# Altium schematic sheet Radio_XBP9X_DMRS_001.SchDoc
size A
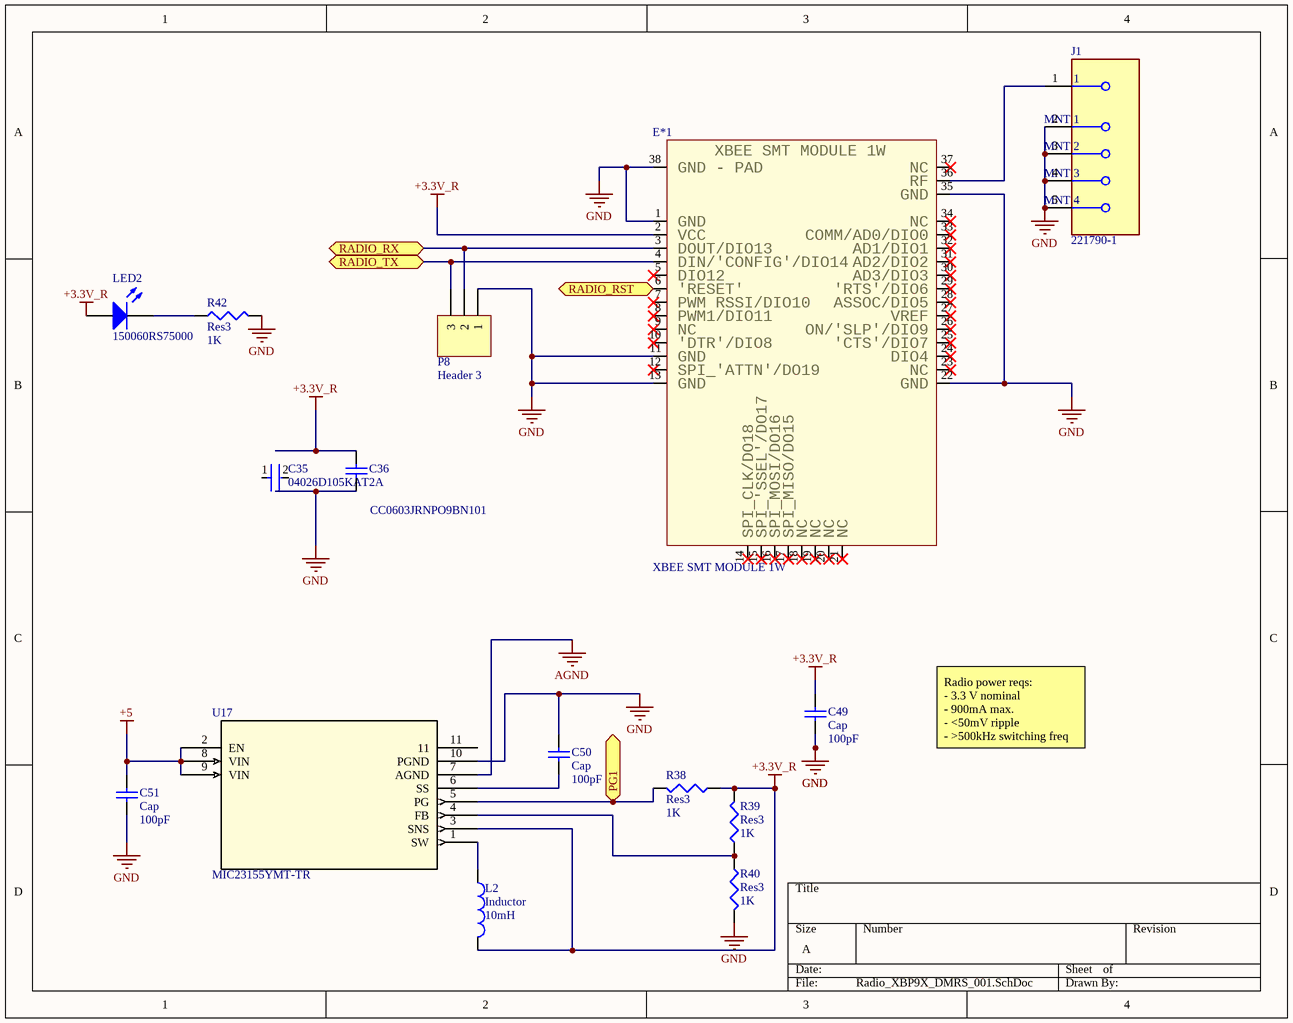
[diagram p0: Radio_XBP9X_DMRS_001.SchDoc]

## Parts
C35  04026D105KAT2A  [FP-0402-L_1_0_1-W_0_5_0_1-MFG]
C36  CC0603JRNPO9BN101  [CAPC1608X90X40ML10T20]
C49  Cap  value 100pF  [RAD-0.3]
C50  Cap  value 100pF  [RAD-0.3]
C51  Cap  value 100pF  [RAD-0.3]
E*1  XBEE SMT MODULE 1W
J1  221790-1  [FP-221790-1-MFG]
L2  Inductor  value 10mH  [0402-A]
LED2  150060RS75000  [0603_A]
P8  Header 3  [HDR1X3]
R38  Res3  value 1K  [J1-0603]
R39  Res3  value 1K  [J1-0603]
R40  Res3  value 1K  [J1-0603]
R42  Res3  value 1K  [J1-0603]
U17  MIC23155YMT-TR  [DFN-10_MCH]

## Ports
PG1 (bidir), RADIO_RST (bidir), RADIO_RX (bidir), RADIO_TX (bidir)

## Nets
+3.3V_R: C36.2 C49.2 E*1.2 L2.2 LED2.2(A) R38.1 R39.2 U17.3(SNS)
+5: C51.2 U17.2(EN) U17.8(VIN) U17.9(VIN)
AGND: U17.7(AGND)
GND: C36.1 C49.1 C50.2 C51.1 E*1.1 E*1.11 E*1.13 E*1.22 E*1.35 E*1.38 J1.2(MNT_1) J1.3(MNT_2) J1.4(MNT_3) J1.5(MNT_4) P8.1 R40.2 R42.2 U17.10(PGND)
PG1: R38.2 U17.5(PG) ; port PG1
RADIO_RST: E*1.6 ; port RADIO_RST
RADIO_RX: E*1.3 P8.2 ; port RADIO_RX
RADIO_TX: E*1.4 P8.3 ; port RADIO_TX
NetC50_1: C50.1 U17.6(SS)
NetE*1_36: E*1.36 J1.1
NetL2_1: L2.1 U17.1(SW)
NetLED2_1: LED2.1(K) R42.1
NetR39_1: R39.1 R40.1 U17.4(FB)

Not connected (* = marked no-connect by the designer): C35 1 2; E*1 5* 7* 8* 9* 10* 12* 14* 15* 16* 17* 18* 19* 20* 21* 23* 24* 25* 26* 27* 28* 29* 30* 31* 32* 33* 34* 37*; U17 11

## Notes on the sheet
- Radio power reqs:
  - 3.3 V nominal
  - 900mA max.
  - <50mV ripple
  - >500kHz switching freq
- (in symbol XBEE SMT MODULE 1W) GND - PAD; NC; RF; GND; VCC; COMM/AD0/DIO0; DOUT/DIO13; AD1/DIO1; DIN/'CONFIG'/DIO14; AD2/DIO2; DIO12; AD3/DIO3; 'RESET'; 'RTS'/DIO6; PWM RSSI/DIO10; ASSOC/DIO5; PWM1/DIO11; VREF; ON/'SLP'/DIO9; 'DTR'/DIO8; 'CTS'/DIO7; DIO4; SPI_'ATTN'/DO19; SPI_CLK/DO18; SPI_'SSEL'/DO17; SPI_MOSI/DO16; SPI_MISO/DO15

## Library data of the parts
C35 = CMP-1034-02113-3: General Purpose Ceramic Capacitor, 0402, 1uF, 10%, X5R, 15%, 6.3V; Tolerance: 10%; Max Operating Temperature: 85°C; Packaging: Tape and Reel; Case Code (Imperial): 0402; Radiation Hardening: No; RoHS Compliant: Yes; Voltage: 6.3V; REACH SVHC: No SVHC; Series: -; Package Quantity: 1; Thickness: 0.022inch; Termination: SMD/SMT; Lead Free: Lead Free; Height: 0.56mm; Mount: Surface Mount; Voltage Rating (DC): 6.3V; Construction: Flat; Min Operating Temperature: -55°C; Capacitance: 1uF; Length: 1mm; Depth: 0.5mm; Voltage Rating: 6.3V; Case Code (Metric): 1005; Contact Plating: Tin; Width: 0.02inch; Case/Package: 0402; Dielectric: X5R
C36 = CMP-2100-03594-1: Chip Capacitor, 100 pF, +/- 5%, 50 V, -55 to 125 degC, 0603 (1608 Metric), RoHS, Tape and Reel; Manufacturer: Yageo; Capacitance: 100pF; Voltage Rating (DC): 50V; Dielectric: C0G; Temperature Coefficient: 30ppm/degC; Insulation Resistance: 100GR; Datasheet Version: Rev. 14, 07/2016; Manufacturer URL: http://www.yageo.com/; Packaging: TapeandReel; Mount: SurfaceMount; RoHSCompliant: True; Package Reference: 0603; Tolerance: 5%; Max Operating Temperature: 125degC; Case Code (Imperial): 0603; Number of Pins: 2; Width: 0.8mm; Case Code (Metric): 1608; Voltage: 50V; REACH SVHC: Unknown; Package Description: 2-Pin Surface Mount Device, Body 1.6 x 0.8 mm; Composition: Ceramic; Lead Free: LeadFree; Min Operating Temperature: -55degC; Radiation Hardening: No; Depth: 0.8mm; Thickness: 0.035inch; Datasheet URL: http://www.yageo.com/documents/recent/UPY-GP_NP0_16V-to-50V_14.pdf; Termination: SMD/SMT; Package Quantity: 1; Length: 1.6mm; Voltage Rating: 50V; Height: 0.8mm; Case/Package: 0603
C49-C51 = Cap: Capacitor; Published: 8-Jun-2000; LatestRevisionDate: 17-Jul-2002; LatestRevisionNote: Re-released for DXP Platform.; PackageReference: RAD-0.3; Publisher: Altium Limited; PackageDescription: Radial Cap, Thru-Hole; 2 Leads; 0.3 in Pin Spacing
J1 = CMP-05166-000001-1: CONN SMA JACK R/A 50 OHM PCB; Manufacturer: TE Connectivity / AMP; Is Female: yes; Impedance: 50Ω; Number Of Contacts: 1; Shielding: true; Voltage Rating: 335V; Frequency: 4GHz; Dielectric Material: Fluoropolymer; Conn Orientation: Right Angle; Octopart: https://octopart.com/2217901-te+connectivity+%2F+amp-3339836; Contact Material: Gold; Temperature: -65°C to +165°C; RoHS: TRUE; Device Class L1: Connectors; Temperature Range Low: -65°C; Mouser Description: RF Connectors / Coaxial Connectors PCB RIGHT ANGLE JACK; Lead Free: Yes; Manufacturer Part Number: 221790-1; Device Class L3: unset; Temperature Range High: +165°C; ComponentLink2URL: https://www.te.com/commerce/DocumentDelivery/DDEController?Action=showdoc&DocId=Customer+Drawing%7F221790%7FB1%7Fpdf%7FEnglish%7FENG_CD_221790_B1.pdf%7F221790-1; Package: 0; ComponentLink2Description: Datasheet; Digikey Description: CONN SMA JACK R/A 50 OHM PCB; Device Class L2: RF / Coaxial Connectors; Category: Conn; Height: 0.38inch; Automotive: No
L2 = Inductor: Code_IEC: 1005; Published: 8-Jun-2000; LatestRevisionDate: 29-May-2009; LatestRevisionNote: IPC-7351 Footprint Added.; PackageReference: 0402-A; Publisher: Altium Limited; PackageDescription: Chip Inductor; Code_JEITA: 0402
LED2 = CMP-1426-00001-1: SMD mono-color Chip LED, WL-SMCW, Red; Manufacturer: Wuerth Elektronik; Color: Red; PackageReference: 0603_A; ComponentLink2URL: http://katalog.we-online.com/led/datasheet/150060RS75000.pdf; ComponentLink1URL: http://www.we-online.com; ComponentLink1Description: Manufacturer URL; ComponentLink2Description: Datasheet; PartNumber: 150060RS75000
P8 = Header 3: Header, 3-Pin; LatestRevisionDate: 17-Jul-2002; LatestRevisionNote: Re-released for DXP Platform.; Publisher: Altium Limited
R38-R40 R42 = Res3: Resistor; Published: 8-Jun-2000; LatestRevisionDate: 29-May-2009; LatestRevisionNote: IPC-7351 Footprint Added.; PackageReference: J1-0603; Publisher: Altium Limited; PackageDescription: Chip Resistor
U17 = MIC23155YMT-TR: No Description Available; Vendor: Microchip; Built_By: EMA_Jessica; SourceLibrary: Microchip_2019-08-23_2; Manufacturer_Part_Number: MIC23155YMT-TR; Copyright: Copyright (C) 2018 Accelerated Designs. All rights reserved; RefDes: RefDes; Type: DEV